# EAGLE schematic elm (EAGLE 4.16)

## Sheet 1 of 3
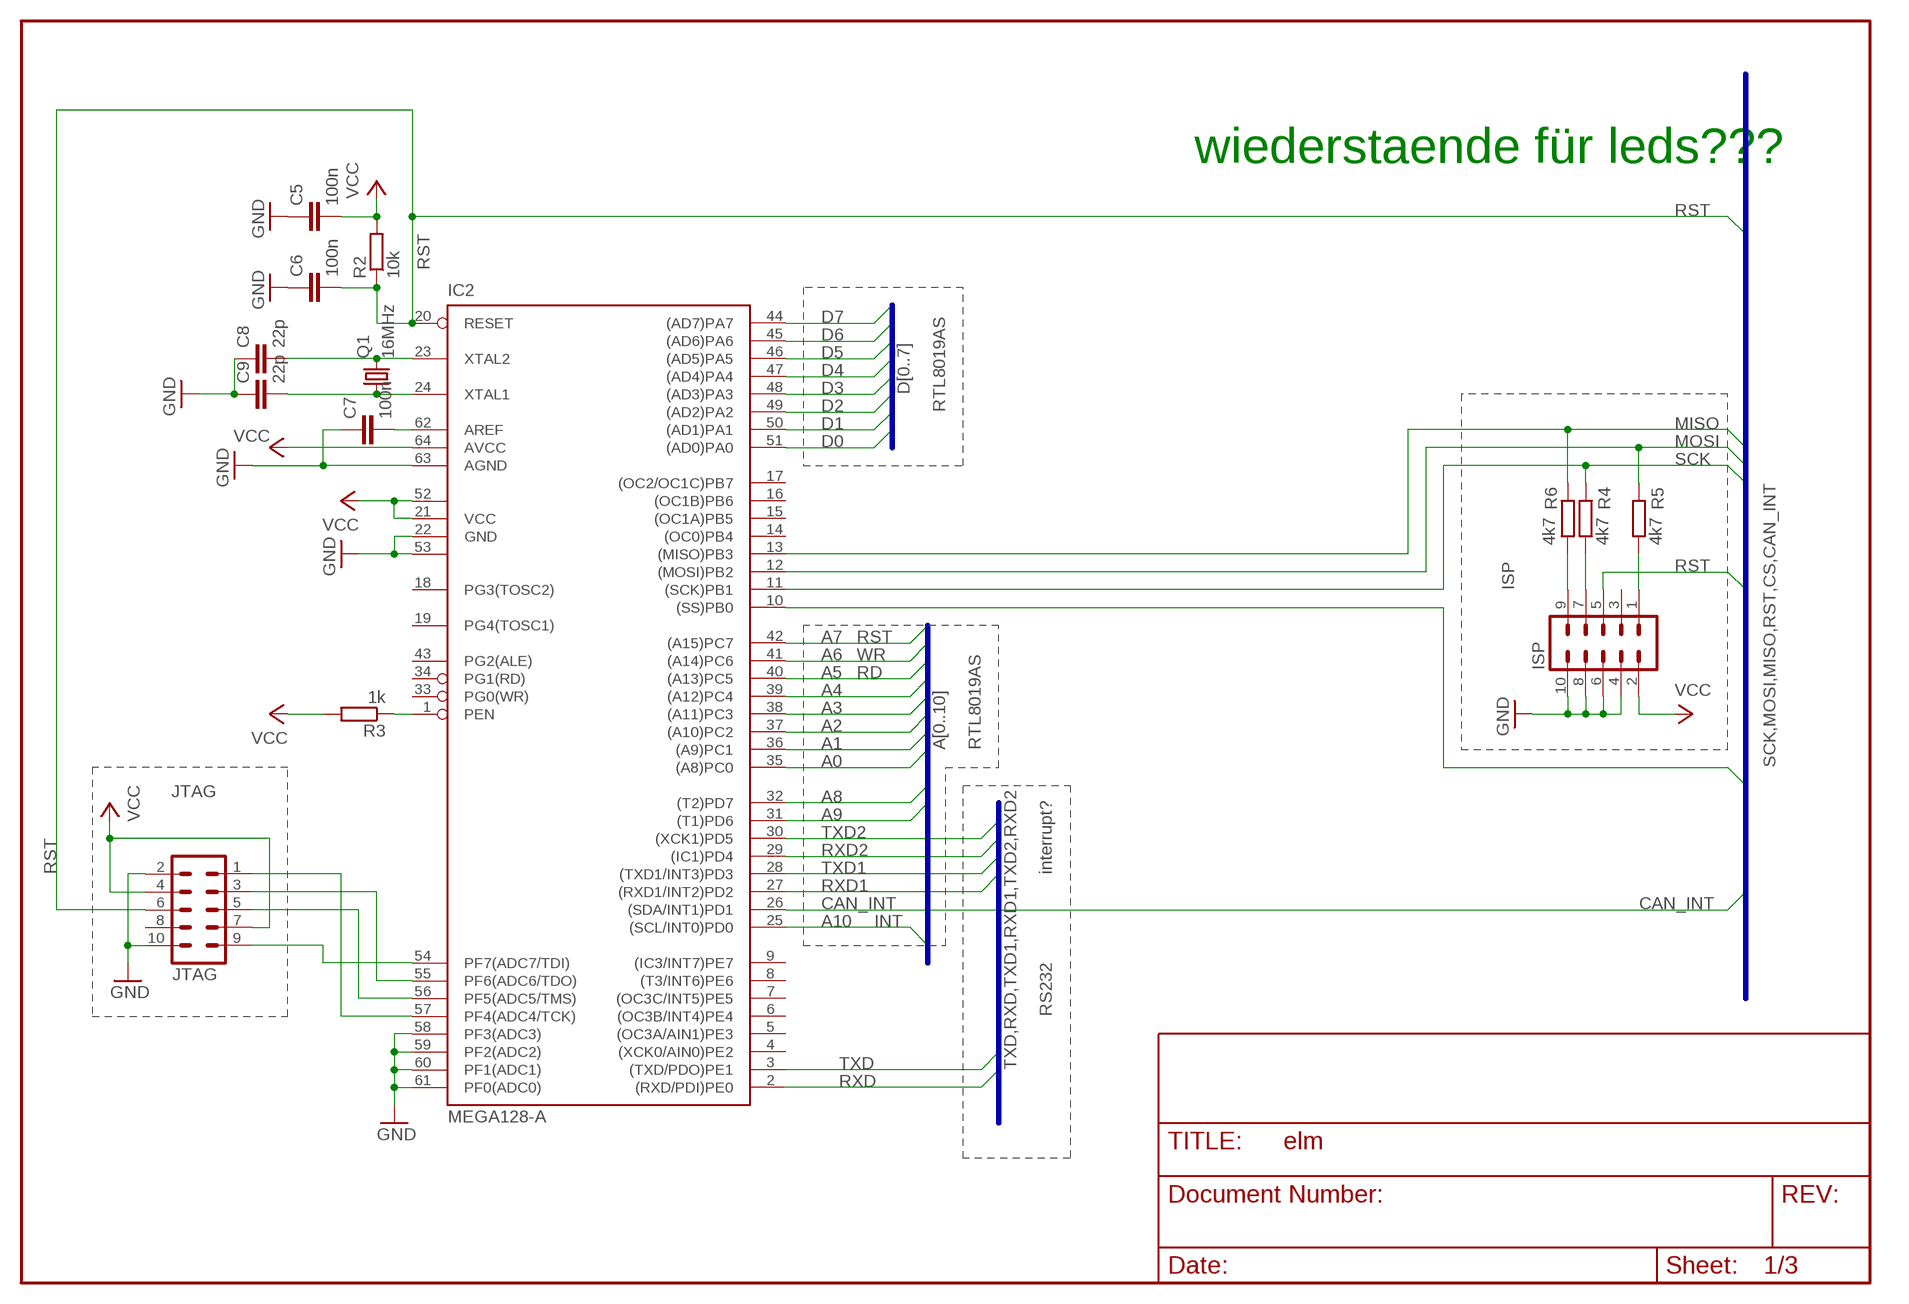
[diagram p0: schematic, sheet 1]

### Parts
C5  100n  C-EUC0603  [C0603]
C6  100n  C-EUC0603  [C0603]
C7  100n  C-EUC0603  [C0603]
C8  22p  C-EUC0603  [C0603]
C9  22p  C-EUC0603  [C0603]
IC2  MEGA128-A  [TQFP64]
ISP  MA05-2  [MA05-2]
JTAG  MA05-2  [MA05-2]
Q1  16MHz  CRYSTALHC49U-V  [HC49U-V]
R2  10k  R-EU_R0805  [R0805]
R3  1k  R-EU_R0805  [R0805]
R4  4k7  R-EU_R0805  [R0805]
R5  4k7  R-EU_R0805  [R0805]
R6  4k7  R-EU_R0805  [R0805]

### Nets
A0: IC2.35((A8)PC0) ; also sheet 3
A1: IC2.36((A9)PC1) ; also sheet 3
A2: IC2.37((A10)PC2) ; also sheet 3
A3: IC2.38((A11)PC3) ; also sheet 3
A4: IC2.39((A12)PC4) ; also sheet 3
A5: IC2.40((A13)PC5) ; also sheet 3
A6: IC2.41((A14)PC6) ; also sheet 3
A7: IC2.42((A15)PC7) ; also sheet 3
A8: IC2.32((T2)PD7) ; also sheet 3
A9: IC2.31((T1)PD6) ; also sheet 3
A10: IC2.25((SCL/INT0)PD0) ; also sheet 3
CAN_INT: IC2.26((SDA/INT1)PD1) ; also sheet 2
CS: IC2.10((SS)PB0) ; also sheet 2
D0: IC2.51((AD0)PA0) ; also sheet 3
D1: IC2.50((AD1)PA1) ; also sheet 3
D2: IC2.49((AD2)PA2) ; also sheet 3
D3: IC2.48((AD3)PA3) ; also sheet 3
D4: IC2.47((AD4)PA4) ; also sheet 3
D5: IC2.46((AD5)PA5) ; also sheet 3
D6: IC2.45((AD6)PA6) ; also sheet 3
D7: IC2.44((AD7)PA7) ; also sheet 3
GND: C5.1 C6.1 C7.1 C8.1 C9.1 IC2.22(GND) IC2.53(GND1) IC2.58(PF3(ADC3)) IC2.59(PF2(ADC2)) IC2.60(PF1(ADC1)) IC2.61(PF0(ADC0)) IC2.63(AGND) ISP.4 ISP.6 ISP.8 ISP.10 JTAG.2 JTAG.10 ; also sheet 2,3
MISO: IC2.13((MISO)PB3) R6.2 ; also sheet 2
MOSI: IC2.12((MOSI)PB2) R5.2 ; also sheet 2
N$5: C7.2 IC2.62(AREF)
N$6: C9.2 IC2.24(XTAL1) Q1.1
N$7: C8.2 IC2.23(XTAL2) Q1.2
N$22: ISP.9 R6.1
N$25: ISP.1 R5.1
N$26: IC2.1(PEN) R3.1
N$29: ISP.7 R4.1
N$68: IC2.54(PF7(ADC7/TDI)) JTAG.9
N$69: IC2.55(PF6(ADC6/TDO)) JTAG.3
N$70: IC2.56(PF5(ADC5/TMS)) JTAG.5
N$71: IC2.57(PF4(ADC4/TCK)) JTAG.1
RST: C6.2 IC2.20(RESET) ISP.5 JTAG.6 R2.1 ; also sheet 2
RXD: IC2.2((RXD/PDI)PE0) ; also sheet 2
RXD1: IC2.27((RXD1/INT2)PD2) ; also sheet 2
RXD2: IC2.29((IC1)PD4) ; also sheet 2
SCK: IC2.11((SCK)PB1) R4.2 ; also sheet 2
TXD: IC2.3((TXD/PDO)PE1) ; also sheet 2
TXD1: IC2.28((TXD1/INT3)PD3) ; also sheet 2
TXD2: IC2.30((XCK1)PD5) ; also sheet 2
VCC: C5.2 IC2.21(VCC) IC2.52(VCC1) IC2.64(AVCC) ISP.2 JTAG.4 JTAG.7 R2.2 R3.2 ; also sheet 2,3
Unconnected: IC2.4((XCK0/AIN0)PE2) IC2.5((OC3A/AIN1)PE3) IC2.6((OC3B/INT4)PE4) IC2.7((OC3C/INT5)PE5) IC2.8((T3/INT6)PE6) IC2.9((IC3/INT7)PE7) IC2.14((OC0)PB4) IC2.15((OC1A)PB5) IC2.16((OC1B)PB6) IC2.17((OC2/OC1C)PB7) IC2.18(PG3(TOSC2)) IC2.19(PG4(TOSC1)) IC2.33(PG0(WR)) IC2.34(PG1(RD)) IC2.43(PG2(ALE)) ISP.3 JTAG.8

### Buses
SCK,MOSI,MISO,RST,CS,CAN_INT
TXD,RXD,TXD1,RXD1,TXD2,RXD2
D[0..7]
A[0..10]

### Notes on the sheet
- wiederstaende für leds???
- RTL8019AS
- ISP
- RST
- WR
- RD
- RTL8019AS
- JTAG
- interrupt?
- INT
- RS232

## Sheet 2 of 3
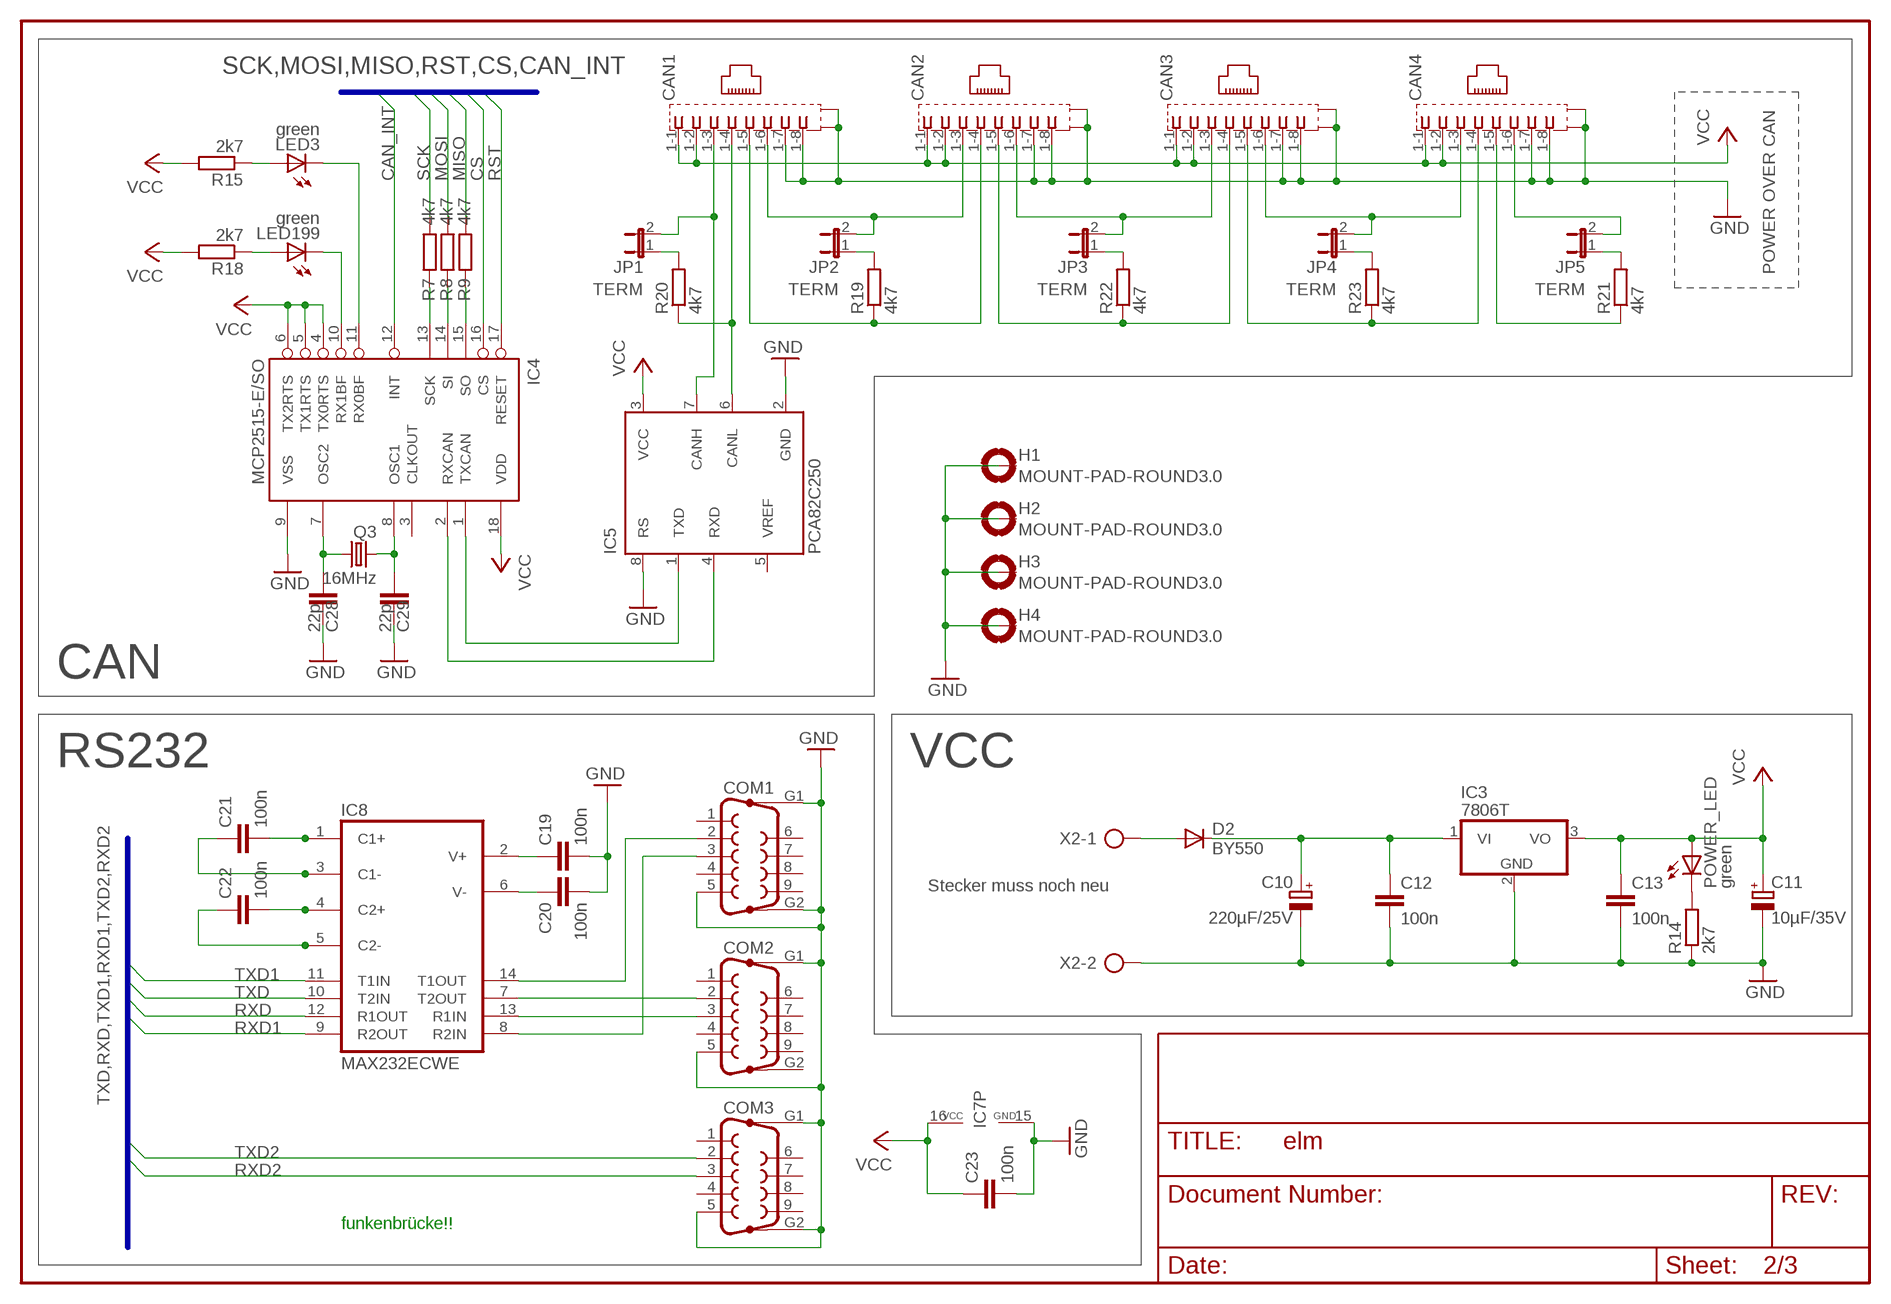
[diagram p1: schematic, sheet 2]

### Parts
C10  220µF/25V  CPOL-EUE3.5-8  [E3,5-8]
C11  10µF/35V  CPOL-EUE3.5-8  [E3,5-8]
C12  100n  C-EUC0603  [C0603]
C13  100n  C-EUC0603  [C0603]
C19  100n  C-EUC0603  [C0603]
C20  100n  C-EUC0603  [C0603]
C21  100n  C-EUC0603  [C0603]
C22  100n  C-EUC0603  [C0603]
C23  100n  C-EUC0603  [C0603]
C28  22p  C-EUC0603  [C0603]
C29  22p  C-EUC0603  [C0603]
CAN1  557786-1  [557786-1]
CAN2  557786-1  [557786-1]
CAN3  557786-1  [557786-1]
CAN4  557786-1  [557786-1]
COM1  F09HP  [F09HP]
COM2  F09HP  [F09HP]
COM3  F09HP  [F09HP]
D2  BY550  [DO27-15]
H1  MOUNT-PAD-ROUND3.0  [3,0-PAD]
H2  MOUNT-PAD-ROUND3.0  [3,0-PAD]
H3  MOUNT-PAD-ROUND3.0  [3,0-PAD]
H4  MOUNT-PAD-ROUND3.0  [3,0-PAD]
IC3  7806T  [TO220H]
IC4  MCP2515-E/SO  [SO18L]
IC5  PCA82C250  [DIL08]
IC7  MAX3232CSE  [SO16]
IC8  MAX232ECWE  [SO16L]
JP1  TERM  JP1E  [JP1]
JP2  TERM  JP1E  [JP1]
JP3  TERM  JP1E  [JP1]
JP4  TERM  JP1E  [JP1]
JP5  TERM  JP1E  [JP1]
LED3  green  LED3MM  [LED3MM]
LED199  green  LED3MM  [LED3MM]
POWER_LED  green  LED3MM  [LED3MM]
Q3  16MHz  CRYSTALHC49U-V  [HC49U-V]
R7  4k7  R-EU_R0805  [R0805]
R8  4k7  R-EU_R0805  [R0805]
R9  4k7  R-EU_R0805  [R0805]
R14  2k7  R-EU_R0805  [R0805]
R15  2k7  R-EU_R0805  [R0805]
R18  2k7  R-EU_R0805  [R0805]
R19  4k7  R-EU_R0805  [R0805]
R20  4k7  R-EU_R0805  [R0805]
R21  4k7  R-EU_R0805  [R0805]
R22  4k7  R-EU_R0805  [R0805]
R23  4k7  R-EU_R0805  [R0805]
X2  AK500/2-H  [AK500/2-H]

### Nets
CAN_INT: IC4.12(INT) ; also sheet 1
CS: IC4.16(CS) ; also sheet 1
GND: C10.- C11.- C12.2 C13.2 C19.2 C20.2 C23.2 C28.2 C29.2 CAN1.1-7 CAN1.1-8 CAN1.G1(S2) CAN1.G2(S1) CAN2.1-7 CAN2.1-8 CAN2.G1(S2) CAN2.G2(S1) CAN3.1-7 CAN3.1-8 CAN3.G1(S2) CAN3.G2(S1) CAN4.1-7 CAN4.1-8 CAN4.G1(S2) CAN4.G2(S1) COM1.5 COM1.G1 COM1.G2 COM2.5 COM2.G1 COM3.5 COM3.G1 COM3.G2 H1.B3,0(MOUNT) H2.B3,0(MOUNT) H3.B3,0(MOUNT) H4.B3,0(MOUNT) IC3.2(GND) IC4.9(VSS) IC5.2(GND) IC5.8(RS) IC7.15(GND) R14.1 X2.2 ; also sheet 1,3
MISO: R9.1 ; also sheet 1
MOSI: R8.1 ; also sheet 1
N$2: IC4.1(TXCAN) IC5.1(TXD)
N$8: C10.+ C12.1 D2.C IC3.1(VI)
N$9: POWER_LED.K(C) R14.2
N$10: D2.A X2.1
N$16: COM2.2 IC8.7(T2OUT)
N$17: COM2.3 IC8.13(R1IN)
N$21: IC4.2(RXCAN) IC5.4(RXD)
N$23: CAN1.1-4 IC5.6(CANL) R20.1
N$27: IC4.11(RX0BF) LED3.K(C)
N$30: CAN4.1-6 JP5.2
N$31: IC4.13(SCK) R7.2
N$32: IC4.14(SI) R8.2
N$33: IC4.15(SO) R9.2
N$38: IC4.10(RX1BF) LED199.K(C)
N$40: C21.2 IC8.1(C1+)
N$41: C22.2 IC8.4(C2+)
N$42: C22.1 IC8.5(C2-)
N$43: C21.1 IC8.3(C1-)
N$46: COM1.2 IC8.14(T1OUT)
N$48: LED3.A R15.1
N$49: COM1.3 IC8.8(R2IN)
N$50: C19.1 IC8.2(V+)
N$51: C20.1 IC8.6(V-)
N$52: LED199.A R18.1
N$53: C28.1 IC4.7(OSC2) Q3.1
N$54: C29.1 IC4.8(OSC1) Q3.2
N$55: CAN1.1-6 CAN2.1-3 JP2.2
N$56: CAN1.1-5 CAN2.1-4 R19.1
N$57: JP2.1 R19.2
N$58: CAN4.1-5 R21.1
N$59: CAN1.1-3 IC5.7(CANH) JP1.2
N$60: JP1.1 R20.2
N$61: JP5.1 R21.2
N$62: CAN2.1-6 CAN3.1-3 JP3.2
N$63: CAN2.1-5 CAN3.1-4 R22.1
N$64: JP3.1 R22.2
N$65: CAN3.1-6 CAN4.1-3 JP4.2
N$66: CAN3.1-5 CAN4.1-4 R23.1
N$67: JP4.1 R23.2
RST: IC4.17(RESET) ; also sheet 1
RXD: IC8.12(R1OUT) ; also sheet 1
RXD1: IC8.9(R2OUT) ; also sheet 1
RXD2: COM3.3 ; also sheet 1
SCK: R7.1 ; also sheet 1
TXD: IC8.10(T2IN) ; also sheet 1
TXD1: IC8.11(T1IN) ; also sheet 1
TXD2: COM3.2 ; also sheet 1
VCC: C11.+ C13.1 C23.1 CAN1.1-1 CAN1.1-2 CAN2.1-1 CAN2.1-2 CAN3.1-1 CAN3.1-2 CAN4.1-1 CAN4.1-2 IC3.3(VO) IC4.4(TX0RTS) IC4.5(TX1RTS) IC4.6(TX2RTS) IC4.18(VDD) IC5.3(VCC) IC7.16(VCC) POWER_LED.A R15.2 R18.2 ; also sheet 1,3
Unconnected: COM1.1 COM1.4 COM1.6 COM1.7 COM1.8 COM1.9 COM2.1 COM2.4 COM2.6 COM2.7 COM2.8 COM2.9 COM2.G2 COM3.1 COM3.4 COM3.6 COM3.7 COM3.8 COM3.9 IC4.3(CLKOUT) IC5.5(VREF) IC7.1(C1+) IC7.2(V+) IC7.3(C1-) IC7.4(C2+) IC7.5(C2-) IC7.6(V-) IC7.7(T2OUT) IC7.8(R2IN) IC7.9(R2OUT) IC7.10(T2IN) IC7.11(T1IN) IC7.12(R1OUT) IC7.13(R1IN) IC7.14(T1OUT)

### Buses
SCK,MOSI,MISO,RST,CS,CAN_INT
TXD,RXD,TXD1,RXD1,TXD2,RXD2

### Notes on the sheet
- POWER OVER CAN
- CAN
- RS232 | VCC
- Stecker muss noch neu
- funkenbrücke!!

## Sheet 3 of 3
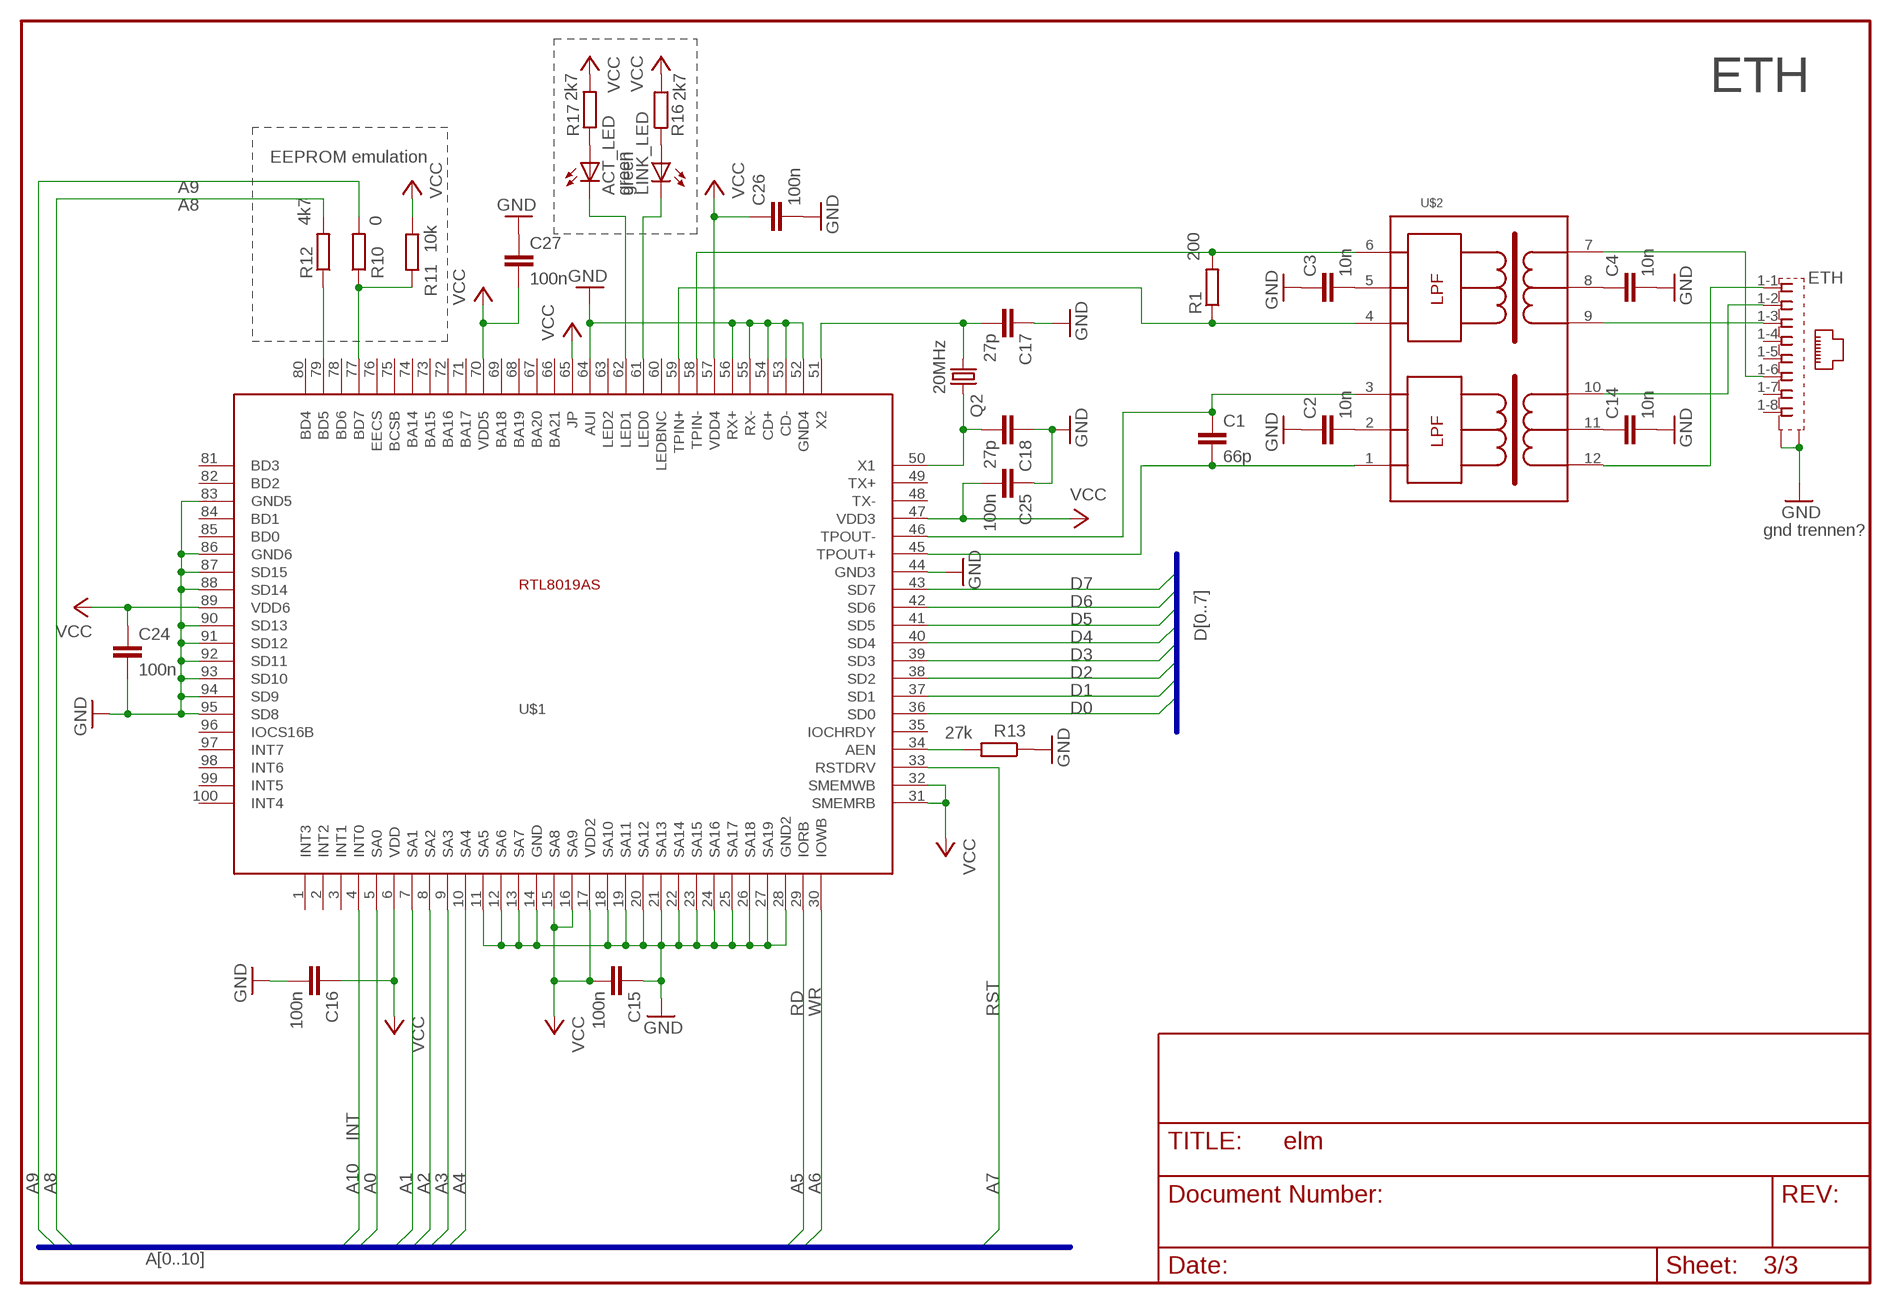
[diagram p2: schematic, sheet 3]

### Parts
ACT_LED  green  LED3MM  [LED3MM]
C1  66p  C-EUC0603  [C0603]
C2  10n  C-EUC0603  [C0603]
C3  10n  C-EUC0603  [C0603]
C4  10n  C-EUC0603  [C0603]
C14  10n  C-EUC0603  [C0603]
C15  100n  C-EUC0603  [C0603]
C16  100n  C-EUC0603  [C0603]
C17  27p  C-EUC0603  [C0603]
C18  27p  C-EUC0603  [C0603]
C24  100n  C-EUC0603  [C0603]
C25  100n  C-EUC0603  [C0603]
C26  100n  C-EUC0603  [C0603]
C27  100n  C-EUC0603  [C0603]
ETH  557786-1  [557786-1]
LINK_LED  green  LED3MM  [LED3MM]
Q2  20MHz  CRYSTALHC49U-V  [HC49U-V]
R1  200  R-EU_R0805  [R0805]
R10  0  R-EU_R0805  [R0805]
R11  10k  R-EU_R0805  [R0805]
R12  4k7  R-EU_R0805  [R0805]
R13  27k  R-EU_R0805  [R0805]
R16  2k7  R-EU_R0805  [R0805]
R17  2k7  R-EU_R0805  [R0805]
U$1  RTL8019AS  [RTL8019AS]
U$2  20F001  [DIL16/12]

### Nets
A0: U$1.5(SA0) ; also sheet 1
A1: U$1.7(SA1) ; also sheet 1
A2: U$1.8(SA2) ; also sheet 1
A3: U$1.9(SA3) ; also sheet 1
A4: U$1.10(SA4) ; also sheet 1
A5: U$1.29(IORB) ; also sheet 1
A6: U$1.30(IOWB) ; also sheet 1
A7: U$1.33(RSTDRV) ; also sheet 1
A8: R12.2 ; also sheet 1
A9: R10.2 ; also sheet 1
A10: U$1.4(INT0) ; also sheet 1
D0: U$1.36(SD0) ; also sheet 1
D1: U$1.37(SD1) ; also sheet 1
D2: U$1.38(SD2) ; also sheet 1
D3: U$1.39(SD3) ; also sheet 1
D4: U$1.40(SD4) ; also sheet 1
D5: U$1.41(SD5) ; also sheet 1
D6: U$1.42(SD6) ; also sheet 1
D7: U$1.43(SD7) ; also sheet 1
GND: C2.1 C3.1 C4.2 C14.2 C15.1 C16.2 C17.1 C18.1 C24.2 C25.1 C26.2 C27.1 ETH.G1(S2) ETH.G2(S1) R13.1 U$1.11(SA5) U$1.12(SA6) U$1.13(SA7) U$1.14(GND) U$1.18(SA10) U$1.19(SA11) U$1.20(SA12) U$1.21(SA13) U$1.22(SA14) U$1.23(SA15) U$1.24(SA16) U$1.25(SA17) U$1.26(SA18) U$1.27(SA19) U$1.28(GND2) U$1.44(GND3) U$1.52(GND4) U$1.53(CD-) U$1.54(CD+) U$1.55(RX-) U$1.56(RX+) U$1.64(AUI) U$1.83(GND5) U$1.86(GND6) U$1.87(SD15) U$1.88(SD14) U$1.90(SD13) U$1.91(SD12) U$1.92(SD11) U$1.93(SD10) U$1.94(SD9) U$1.95(SD8) ; also sheet 1,2
N$1: R1.2 U$1.58(TPIN-) U$2.6
N$3: R1.1 U$1.59(TPIN+) U$2.4
N$4: C1.1 U$1.46(TPOUT-) U$2.3
N$11: C1.2 U$1.45(TPOUT+) U$2.1
N$12: C3.2 U$2.5
N$13: C2.2 U$2.2
N$14: C14.1 U$2.11
N$15: C4.1 U$2.8
N$18: ETH.1-1 U$2.12
N$19: ETH.1-2 U$2.10
N$20: ETH.1-3 U$2.9
N$24: ETH.1-6 U$2.7
N$28: LINK_LED.A R16.1
N$34: C17.2 Q2.2 U$1.51(X2)
N$35: C18.2 Q2.1 U$1.50(X1)
N$36: R10.1 R11.2 U$1.77(BD7)
N$37: R12.1 U$1.79(BD5)
N$39: R13.2 U$1.34(AEN)
N$44: ACT_LED.A R17.1
N$45: LINK_LED.K(C) U$1.61(LED0)
N$47: ACT_LED.K(C) U$1.62(LED1)
VCC: C15.2 C16.1 C24.1 C25.2 C26.1 C27.2 R11.1 R16.2 R17.2 U$1.6(VDD) U$1.15(SA8) U$1.16(SA9) U$1.17(VDD2) U$1.31(SMEMRB) U$1.32(SMEMWB) U$1.47(VDD3) U$1.57(VDD4) U$1.65(JP) U$1.70(VDD5) U$1.89(VDD6) ; also sheet 1,2
Unconnected: ETH.1-4 ETH.1-5 ETH.1-7 ETH.1-8 U$1.1(INT3) U$1.2(INT2) U$1.3(INT1) U$1.35(IOCHRDY) U$1.48(TX-) U$1.49(TX+) U$1.60(LEDBNC) U$1.63(LED2) U$1.66(BA21) U$1.67(BA20) U$1.68(BA19) U$1.69(BA18) U$1.71(BA17) U$1.72(BA16) U$1.73(BA15) U$1.74(BA14) U$1.75(BCSB) U$1.76(EECS) U$1.78(BD6) U$1.80(BD4) U$1.81(BD3) U$1.82(BD2) U$1.84(BD1) U$1.85(BD0) U$1.96(IOCS16B) U$1.97(INT7) U$1.98(INT6) U$1.99(INT5) U$1.100(INT4)

### Buses
D[0..7]
A[0..10]

### Notes on the sheet
- ETH
- EEPROM emulation
- gnd trennen?
- RD | WR | RST
- INT

## Power pins joined to a net without a drawn wire
GND: IC8.15(GND)
VCC: IC8.16(VCC)

## Library data of the parts
ACT_LED LED3 LED199 LINK_LED POWER_LED = led:LED: LED OSRAM: - CHIPLED LG R971, LG N971, LY N971, LG Q971, LY Q971, LO R971, LY R971 LH N974, LH R974 LS Q976, LO Q976, LY Q976 LO Q996 - Hyper CHIPLED LW Q18S LB Q993, LB Q99A, LB R99A - SideLED LS A670, LO A670, LY A670, LG A670, LP A670 LB A673, LV A673, LT A673, LW A673 LH A674 LY A675 LS A676, LA A676, LO A676, LY A676, LW A676 LS A679, LY A679, LG A679 - Hyper Micro SIDELED® LS Y876, LA Y876, LO Y876, LY Y876 LT Y87S - SmartLED LW L88C, LW L88S LB L89C, LB L89S, LG L890 LS L89K, LO L89K, LY L89K LS L896, LA L896, LO L896, LY L896 - TOPLED LS T670, LO T670, LY T670, LG T670, LP T670 LSG T670, LSP T670, LSY T670, LOP T670, LYG T670 LG T671, LOG T671, LSG T671 LB T673, LV T673, LT T673, LW T673 LH T674 LS T676, LA T676, LO T676, LY T676, LB T676, LH T676, LSB T676, LW T676 LB T67C, LV T67C, LT T67C, LS T67K, LO T67K, LY T67K, LW E67C LS E67B, LA E67B, LO E67B, LY E67B, LB E67C, LV E67C, LT E67C LW T67C LS T679, LY T679, LG T679 LS T770, LO T770, LY T770, LG T770, LP T770 LB T773, LV T773, LT T773, LW T773 LH T774 LS E675, LA E675, LY E675, LS T675 LS T776, LA T776, LO T776, LY T776, LB T776 LHGB T686 LT T68C, LB T68C - Hyper Mini TOPLED® LB M676 - Mini TOPLED Santana® LG M470 LS M47K, LO M47K, LY M47K Source: http://www.osram.convergy.de - LUMILED® LXK2-PW12-R00, LXK2-PW12-S00, LXK2-PW14-U00, LXK2-PW14-V00 LXK2-PM12-R00, LXK2-PM12-S00, LXK2-PM14-U00 LXK2-PE12-Q00, LXK2-PE12-R00, LXK2-PE12-S00, LXK2-PE14-T00, LXK2-PE14-U00 LXK2-PB12-K00, LXK2-PB12-L00, LXK2-PB12-M00, LXK2-PB14-N00, LXK2-PB14-P00, LXK2-PB14-Q00 LXK2-PR12-L00, LXK2-PR12-M00, LXK2-PR14-Q00, LXK2-PR14-R00 LXK2-PD12-Q00, LXK2-PD12-R00, LXK2-PD12-S00 LXK2-PH12-R00, LXK2-PH12-S00 LXK2-PL12-P00, LXK2-PL12-Q00, LXK2-PL12-R00 Source: www.luxeon.com
C1-C9 C12-C29 = rcl:C-EU: CAPACITOR, European symbol
C10 C11 = rcl:CPOL-EU: POLARIZED CAPACITOR, European symbol
CAN1-CAN4 ETH = con-amp:557786-1: AMP connector
COM1-COM3 = con-subd:F09HP: SUB-D
D2 = diode:BY550: DIODE Si200 V, 5 A
H1-H4 = holes:MOUNT-PAD-ROUND: MOUNTING PAD, round
IC2 = atmel:MEGA128: MICROCONTROLLER 128 Kbytes FLASH 4 Kbytes SRAM 4 Kbytes EEPROM DUAL USART 8-channel 10 bit ADC Source: avr.lbr
IC3 = linear:78*: Positive VOLTAGE REGULATOR Source: http://cache.national.com/ds/LM/LM78L05.pdf http://www.fairchildsemi.com/ds/LM/LM7805.pdf
IC4 = mcp2515:MCP2515
IC5 = micro-philips:PCA82C250: CAN CONTROLLER INTERFACE
IC7 = maxim:MAX3232*: True RS-232 Transceivers 3.0V to 5.5V, Low-Power up to 1Mbps, Using Four 0.1µF External Capacitors Source: http://pdfserv.maxim-ic.com/en/ds/MAX3222-MAX3241.pdf
IC8 = maxim:MAX232ECWE: RS232 TRANSEIVER
ISP JTAG = con-lstb:MA05-2: PIN HEADER
JP1-JP5 = jumper:JP1E: JUMPER
Q1-Q3 = crystal:CRYSTAL: CRYSTAL
R1-R23 = rcl:R-EU_: RESISTOR, European symbol
U$1 = rtl8019as:RTL8019AS
U$2 = Realtek:20F001
X2 = con-ptr500:AK500/2-H: CONNECTOR Aug. 2004 / PTR Meßtechnik: Die Bezeichnung der Serie AK505 wurde geändert. Es handelt sich hierbei um AK500 in horizontaler Ausführung.